# Altium project USB_Sniffer.PrjPcb
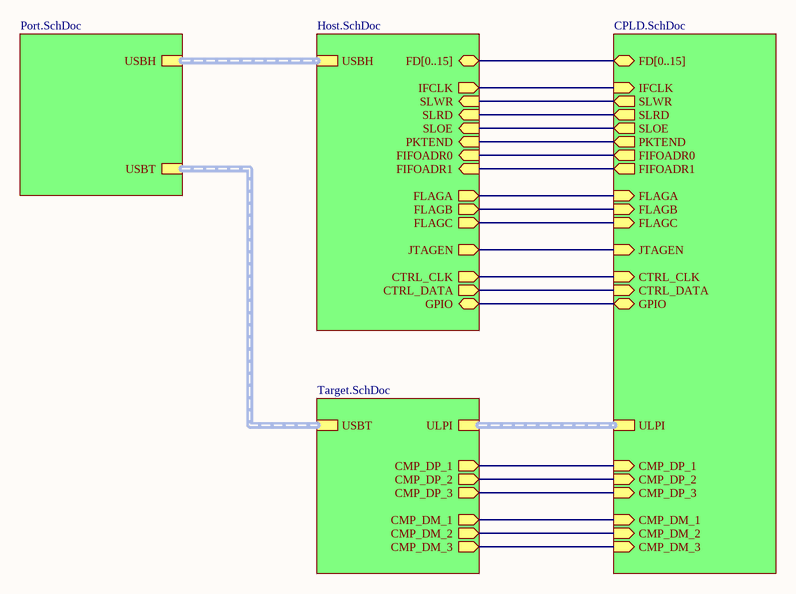
[diagram p0: Main.SchDoc]
5 sheets, 83 parts. Net scope: hierarchical (ports join the sheet entries above them; power ports are global).
Board file: USB_Sniffer.PcbDoc
Sheets:
  Main.SchDoc
    U_Port = Port.SchDoc
    U_Host = Host.SchDoc
    U_CPLD = CPLD.SchDoc
    U_Target = Target.SchDoc

## Sheet Main.SchDoc: Main
size A4; DocumentNumber: 1; SheetNumber: 1; SheetTotal: 5

### Sub-sheets
U_CPLD = CPLD.SchDoc: CTRL_CLK (in), JTAGEN (in), SLOE (out), FIFOADR0 (out), FIFOADR1 (out), PKTEND (out), GPIO (bidir), FD[0..15] (bidir), SLRD (out), SLWR (out), FLAGA (in), FLAGB (in), FLAGC (in), IFCLK (in), ULPI (harness ULPI), CMP_DM_1 (in), CMP_DP_1 (in), CMP_DP_2 (in), CMP_DM_2 (in), CMP_DP_3 (in), CMP_DM_3 (in), CTRL_DATA (in)
U_Host = Host.SchDoc: USBH (harness USB), CTRL_CLK (out), JTAGEN (out), SLOE (in), CTRL_DATA (out), FIFOADR0 (in), FIFOADR1 (in), PKTEND (in), GPIO (bidir), FD[0..15] (bidir), SLRD (in), SLWR (in), FLAGA (out), FLAGB (out), FLAGC (out), IFCLK (out)
U_Port = Port.SchDoc: USBH (harness USB), USBT (harness USB)
U_Target = Target.SchDoc: USBT (harness USB), ULPI (harness ULPI), CMP_DM_1 (out), CMP_DP_1 (out), CMP_DP_2 (out), CMP_DM_2 (out), CMP_DP_3 (out), CMP_DM_3 (out)

### Nets
CMP_DM_1: sheet U_CPLD/CMP_DM_1, sheet U_Target/CMP_DM_1
CMP_DM_2: sheet U_CPLD/CMP_DM_2, sheet U_Target/CMP_DM_2
CMP_DM_3: sheet U_CPLD/CMP_DM_3, sheet U_Target/CMP_DM_3
CMP_DP_1: sheet U_CPLD/CMP_DP_1, sheet U_Target/CMP_DP_1
CMP_DP_2: sheet U_CPLD/CMP_DP_2, sheet U_Target/CMP_DP_2
CMP_DP_3: sheet U_CPLD/CMP_DP_3, sheet U_Target/CMP_DP_3
CTRL_CLK: sheet U_Host/CTRL_CLK, sheet U_CPLD/CTRL_CLK
CTRL_DATA: sheet U_Host/CTRL_DATA, sheet U_CPLD/CTRL_DATA
FIFOADR0: sheet U_Host/FIFOADR0, sheet U_CPLD/FIFOADR0
FIFOADR1: sheet U_Host/FIFOADR1, sheet U_CPLD/FIFOADR1
FLAGA: sheet U_Host/FLAGA, sheet U_CPLD/FLAGA
FLAGB: sheet U_Host/FLAGB, sheet U_CPLD/FLAGB
FLAGC: sheet U_Host/FLAGC, sheet U_CPLD/FLAGC
GPIO: sheet U_Host/GPIO, sheet U_CPLD/GPIO
IFCLK: sheet U_Host/IFCLK, sheet U_CPLD/IFCLK
JTAGEN: sheet U_Host/JTAGEN, sheet U_CPLD/JTAGEN
PKTEND: sheet U_Host/PKTEND, sheet U_CPLD/PKTEND
SLOE: sheet U_Host/SLOE, sheet U_CPLD/SLOE
SLRD: sheet U_Host/SLRD, sheet U_CPLD/SLRD
SLWR: sheet U_Host/SLWR, sheet U_CPLD/SLWR

### Buses and harness runs
bus sheet U_CPLD/FD[0..15] = sheet U_Host/FD[0..15]
harness sheet U_CPLD/ULPI = sheet U_Target/ULPI
harness sheet U_Host/USBH = sheet U_Port/USBH
harness sheet U_Port/USBT = sheet U_Target/USBT

### Notes on the sheet
- Title
- Size:
- Date:
- A4
- Number:
- Time:
- Revision:
- Sheet
- of
- File:

## Sheet Port.SchDoc: Port
size A4; DocumentNumber: 2; SheetNumber: 2; SheetTotal: 5
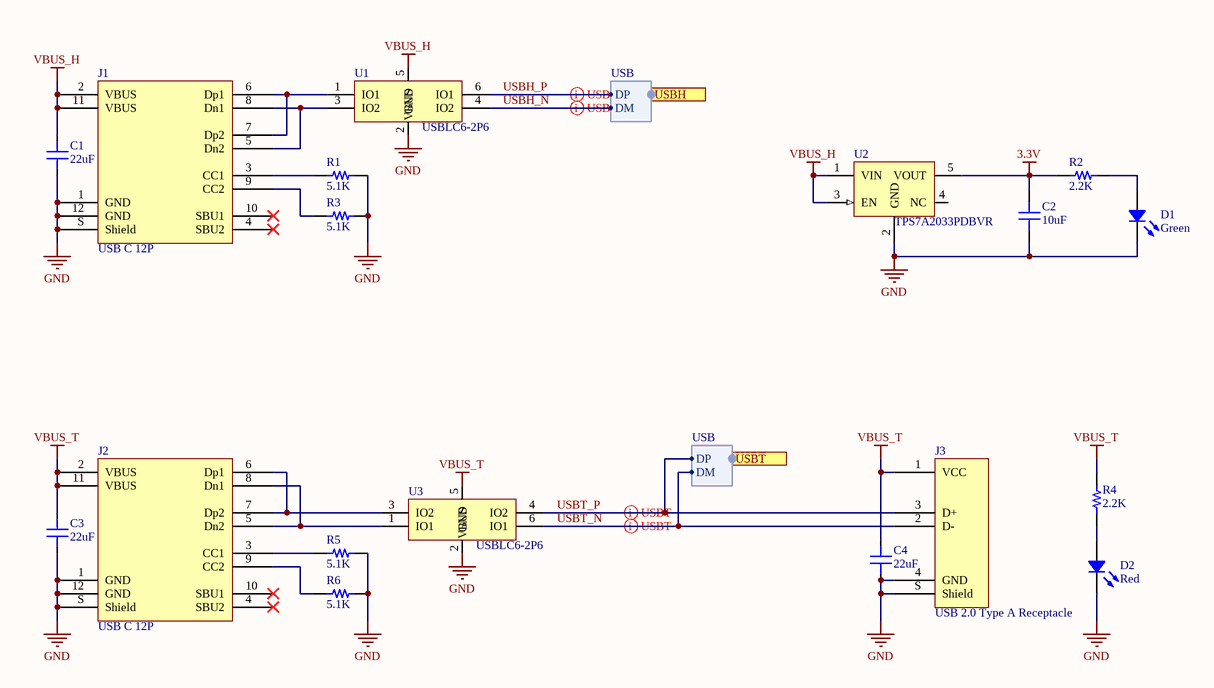
[diagram p1: Port.SchDoc]

### Parts
C1  22uF  [CAP 0805/2012]
C2  10uF  [CAP 0603/1608]
C3  22uF  [CAP 0805/2012]
C4  22uF  [CAP 0805/2012]
D1  Green  [LED 0603/1608 GREEN]
D2  Red  [LED 0603/1608 RED]
J1  USB C 12P  [JAE USB DX07S016JA1R1500]
J2  USB C 12P  [JAE USB DX07S016JA1R1500]
J3  USB 2.0 Type A Receptacle  [629104151021]
R1  5.1K  [RES 0402/1005]
R2  2.2K  [RES 0402/1005]
R3  5.1K  [RES 0402/1005]
R4  2.2K  [RES 0402/1005]
R5  5.1K  [RES 0402/1005]
R6  5.1K  [RES 0402/1005]
U1  USBLC6-2P6  [SOTFL50P160X60-6N]
U2  TPS7A2033PDBVR  [SOT95P280X110-5N]
U3  USBLC6-2P6  [SOTFL50P160X60-6N]

### Ports
USBH (harness USB), USBT (harness USB)

### Harnesses
USB: DP, DM

### Nets
3.3V: C2.2 R2.2 U2.5(VOUT)
GND: C1.1 C2.1 C3.1 C4.1 D1.2 D2.2 J1.1(GND) J1.12(GND) J1.S(Shield) J2.1(GND) J2.12(GND) J2.S(Shield) J3.4(GND) J3.S(Shield) R1.1 R3.1 R5.1 R6.1 U1.2(GND) U2.2(GND) U3.2(GND)
VBUS_H: C1.2 J1.2(VBUS) J1.11(VBUS) U1.5(VBUS) U2.1(VIN) U2.3(EN)
VBUS_T: C3.2 C4.2 J2.2(VBUS) J2.11(VBUS) J3.1(VCC) R4.1 U3.5(VBUS)
USBH_N: U1.4(IO2) ; port USBH.DM
USBH_P: U1.6(IO1) ; port USBH.DP
USBT_N: J3.2(D-) U3.6(IO1) ; port USBT.DM
USBT_P: J3.3(D+) U3.4(IO2) ; port USBT.DP
NetD1_1: D1.1 R2.1
NetD2_1: D2.1 R4.2
NetJ1_3: J1.3(CC1) R1.2
NetJ1_5: J1.5(Dn2) J1.8(Dn1) U1.3(IO2)
NetJ1_6: J1.6(Dp1) J1.7(Dp2) U1.1(IO1)
NetJ1_9: J1.9(CC2) R3.2
NetJ2_3: J2.3(CC1) R5.2
NetJ2_5: J2.5(Dn2) J2.8(Dn1) U3.1(IO1)
NetJ2_6: J2.6(Dp1) J2.7(Dp2) U3.3(IO2)
NetJ2_9: J2.9(CC2) R6.2

Not connected (* = marked no-connect by the designer): J1 4(SBU2)* 10(SBU1)*; J2 4(SBU2)* 10(SBU1)*; U2 4(NC)

### Layout directives
differential pair: USBH_N, USBH_P, USBT_N, USBT_P

### Notes on the sheet
- Title
- Size:
- Date:
- A4
- Number:
- Time:
- Revision:
- Sheet
- of
- File:

### Library data of the parts
C1 C3 C4 = CM1163: CAP CER 22UF 10V X5R 0805; Part Number: GRM219R61A226MEA0D; Manufacturer: Murata; TemperatureRange: -55C ~ 85C; Tolerance: 20%; Value: 22uF; PartId: CM1163; Supplier 1: Digi-Key; Supplier Part Number 1: 490-9951-2-ND; ComponentLink1Description: Datasheet; ComponentLink1URL: http://www.murata.com/~/media/webrenewal/support/library/catalog/products/capacitor/mlcc/c02e.pdf; ComponentLink2Description: Digi-Key Listing; ComponentLink2URL: https://www.digikey.com/product-detail/en/murata-electronics-north-america/GRM219R61A226MEA0D/490-9951-2-ND/4905417; TemperatureCoefficient: X5R; Voltage: 10V; Price: 0.0844; Device Package: 0805 (2012 Metric)
C2 = CM0905: CAP CER 10UF 25V X5R 0603; Part Number: GRM188R61E106MA73D; Manufacturer: Murata; TemperatureRange: -55C ~ 85C; Tolerance: 20%; Value: 10uF; PartId: CM0905; Supplier 1: Digi-Key; Supplier Part Number 1: 490-7202-2-ND; ComponentLink1Description: Datasheet; ComponentLink1URL: http://www.murata.com/~/media/webrenewal/support/library/catalog/products/capacitor/mlcc/c02e.pdf; ComponentLink2Description: Digi-Key Listing; ComponentLink2URL: https://www.digikey.com/product-detail/en/murata-electronics-north-america/GRM188R61E106MA73D/490-7202-2-ND/3900497; TemperatureCoefficient: X5R; Voltage: 25V; Price: 0.0858; Device Package: 0603 (1608 Metric)
D1 = LS0044: LED GREEN CLEAR 0603 SMD; Part Number: LTST-C191KGKT; Manufacturer: Lite-On Inc.; Type: Surface Mount; Millicandela: 35mcd; Voltage Forward: 2V; Current (Test): 20mA; Viewing Angle: 130; Value: Green; Colour: Green; PartId: LS0044; Supplier 1: Digi-Key; Supplier Part Number 1: 160-1446-2-ND; ComponentLink1Description: Datasheet; ComponentLink1URL: http://optoelectronics.liteon.com/upload/download/DS22-2000-228/LTST-C191KGKT.pdf; ComponentLink2Description: Digi-Key Listing; ComponentLink2URL: http://www.digikey.ca/product-detail/en/LTST-C191KGKT/160-1446-2-ND/386835; Price: 0.0521; Device Package: 0603 (1608 Metric); Lens Transparency: Clear
D2 = LS0043: LED RED CLEAR 0603 SMD; Part Number: LTST-C191KRKT; Manufacturer: Lite-On Inc.; Value: Green; Millicandela: 54mcd; Voltage Forward: 2V; Current (Test): 20mA; Viewing Angle: 130; Colour: Red; PartId: LS0043; Supplier 1: Digi-Key; Supplier Part Number 1: 160-1447-2-ND; ComponentLink1Description: Datasheet; ComponentLink1URL: http://optoelectronics.liteon.com/upload/download/DS22-2000-223/LTST-C191KRKT.pdf; ComponentLink2Description: Digi-Key Listing; ComponentLink2URL: http://www.digikey.ca/product-detail/en/LTST-C191KRKT/160-1447-2-ND/386837; Price: 0.0521; Device Package: 0603 (1608 Metric); Lens Transparency: Clear
J1 J2 = CU0055: USB 2.0 Type C, Receptacle, Horizontal, SMT; Part Number: DX07S016JA1R1500; Manufacturer: JAE; Number Of Positions: 12; PartId: CU0055; Supplier 1: Digi-Key; Supplier Part Number 1: 670-DX07S016JA1R1500CT-ND; ComponentLink1Description: Datasheet; ComponentLink1URL: https://www.jae.com/en/connectors/series/detail/product/id=91780&type_code=T1010; Supplier 2: Mouser; Supplier Part Number 2: 656-DX07S016JA1R1500; Type: USB - C
J3 = CU0022: USB 2.0 Type A, Receptacle, Horizontal, SMT, with Pegs; Manufacturer: Wurth; Number Of Positions: 4; PartId: CU0022; Part Number: 629104151021; Supplier 1: Mouser; Supplier Part Number 1: 710-629104151021; ComponentLink1Description: Datasheet; ComponentLink1URL: https://www.we-online.com/components/products/datasheet/629104151021.pdf; Type: USB - A
R1 R3 R5 R6 = RC1490: RES SMD 5.1K OHM 1% 1/16W 0402; Part Number: RC0402FR-075K1L; Manufacturer: Yageo; TemperatureRange: -55C ~ 155C; TemperatureCoefficient: 100ppm/C; PowerRating: 0.0625W, 1/16W; Value: 5.1K; PartId: RC1490; Supplier 1: Mouser; Supplier Part Number 1: 603-RC0402FR-075K1L; ComponentLink1Description: Datasheet; ComponentLink1URL: http://www.yageo.com/NewPortal/yageodocoutput?fileName=/pdf/R-Chip/PYu-RC_Group_51_RoHS_L_9.pdf; Tolerance: 1%; Price: 0.0043; Type: Thick Film; Device Package: 0402 (1005 Metric)
R2 R4 = RC1434: RES SMD 2.2K OHM 1% 1/16W 0402; Part Number: RC0402FR-072K2L; Manufacturer: Yageo; TemperatureRange: -55C ~ 155C; TemperatureCoefficient: 100ppm/C; PowerRating: 0.0625W, 1/16W; PartId: RC1434; Value: 2.2K; Supplier 1: Mouser; Supplier Part Number 1: 603-RC0402FR-072K2L; ComponentLink1Description: Datasheet; ComponentLink1URL: http://www.yageo.com/NewPortal/yageodocoutput?fileName=/pdf/R-Chip/PYu-RC_Group_51_RoHS_L_9.pdf; Tolerance: 1%; Price: 0.0043; Type: Thick Film; Device Package: 0402 (1005 Metric)
U1 U3 = IIF001: TVS ARRAY SOT666; Manufacturer: ST; PartId: IIF001; Part Number: USBLC6-2P6; Supplier 1: Digi-Key; Supplier Part Number 1: 497-5026-1-ND; Supplier 2: Farnell; Supplier Part Number 2: 1295310; ComponentLink1Description: Datasheet; ComponentLink1URL: http://www.st.com/resource/en/datasheet/usblc6-2.pdf; Price: 0.58; Type: ESD Diode; Device Package: SOTFL-6; Operating Temperature: -40C ~ 125C
U2 = URL111: LDO 3.3V 300MA SOT23-5; Manufacturer: TI; Input Voltage MAX: 5.5V; PartId: URL111; Part Number: TPS7A2033PDBVR; Supplier 1: Mouser; Supplier Part Number 1: 595-TPS7A2033PDBVR; ComponentLink1Description: Datasheet; ComponentLink1URL: https://www.ti.com/lit/ds/symlink/tps7a20.pdf; Price: 0.15; Type: LDO; Device Package: SOT23-5; Operating Temperature: -40C ~ 125C; Output Voltage: 3.3V; Output Current: 300mA

## Sheet Host.SchDoc: MCU
size A4; DocumentNumber: 3; SheetNumber: 3; SheetTotal: 5
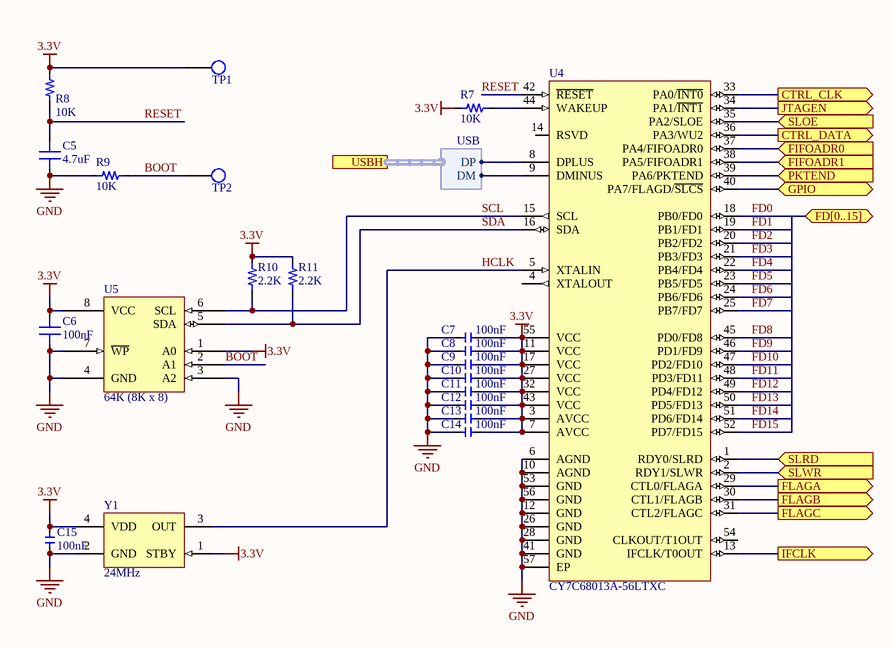
[diagram p2: Host.SchDoc]

### Parts
C5  4.7uF  [CAP 0402/1005]
C6  100nF  [CAP 0402/1005]
C7  100nF  [CAP 0402/1005]
C8  100nF  [CAP 0402/1005]
C9  100nF  [CAP 0402/1005]
C10  100nF  [CAP 0402/1005]
C11  100nF  [CAP 0402/1005]
C12  100nF  [CAP 0402/1005]
C13  100nF  [CAP 0402/1005]
C14  100nF  [CAP 0402/1005]
C15  100nF  [CAP 0402/1005]
R7  10K  [RES 0402/1005]
R8  10K  [RES 0402/1005]
R9  10K  [RES 0402/1005]
R10  2.2K  [RES 0402/1005]
R11  2.2K  [RES 0402/1005]
TP1  Test Point  [TP 1MM]  (value not drawn)  (no BOM)
TP2  Test Point  [TP 1MM]  (value not drawn)  (no BOM)
U4  CY7C68013A-56LTXC  [QFN50P800X800X90_HS-57N]
U5  64K (8K x 8)  [MICROCHIP TSSOP-8 ST]
Y1  24MHz  [WE-SPXO_IQXO-540]

### Ports
CTRL_CLK (out), CTRL_DATA (out), FD[0..15] (bidir), FIFOADR0 (in), FIFOADR1 (in), FLAGA (out), FLAGB (out), FLAGC (out), GPIO (bidir), IFCLK (out), JTAGEN (out), PKTEND (in), SLOE (in), SLRD (in), SLWR (in), USBH (harness USB)

### Harnesses
USB: DP, DM

### Nets
3.3V: C6.1 C7.1 C8.2 C9.2 C10.2 C11.2 C12.2 C13.2 C14.2 C15.1 R7.2 R8.2 R10.2 R11.2 TP1.1 U4.3(AVCC) U4.7(AVCC) U4.11(VCC) U4.17(VCC) U4.27(VCC) U4.32(VCC) U4.43(VCC) U4.55(VCC) U5.1(A0) U5.8(VCC) Y1.1(STBY) Y1.4(VDD)
GND: C5.2 C6.2 C7.2 C8.1 C9.1 C10.1 C11.1 C12.1 C13.1 C14.1 C15.2 R9.1 U4.6(AGND) U4.10(AGND) U4.12(GND) U4.26(GND) U4.28(GND) U4.41(GND) U4.53(GND) U4.56(GND) U4.57(EP) U5.3(A2) U5.4(GND) U5.7(~{WP}) Y1.2(GND)
BOOT: R9.2 TP2.1 U5.2(A1)
CTRL_CLK: U4.33(PA0/~{INT0}) ; port CTRL_CLK
CTRL_DATA: U4.36(PA3/WU2) ; port CTRL_DATA
FD0: U4.18(PB0/FD0)
FD1: U4.19(PB1/FD1)
FD2: U4.20(PB2/FD2)
FD3: U4.21(PB3/FD3)
FD4: U4.22(PB4/FD4)
FD5: U4.23(PB5/FD5)
FD6: U4.24(PB6/FD6)
FD7: U4.25(PB7/FD7)
FD8: U4.45(PD0/FD8)
FD9: U4.46(PD1/FD9)
FD10: U4.47(PD2/FD10)
FD11: U4.48(PD3/FD11)
FD12: U4.49(PD4/FD12)
FD13: U4.50(PD5/FD13)
FD14: U4.51(PD6/FD14)
FD15: U4.52(PD7/FD15)
FIFOADR0: U4.37(PA4/FIFOADR0) ; port FIFOADR0
FIFOADR1: U4.38(PA5/FIFOADR1) ; port FIFOADR1
FLAGA: U4.29(CTL0/FLAGA) ; port FLAGA
FLAGB: U4.30(CTL1/FLAGB) ; port FLAGB
FLAGC: U4.31(CTL2/FLAGC) ; port FLAGC
GPIO: U4.40(PA7/FLAGD/~{SLCS}) ; port GPIO
HCLK: U4.5(XTALIN) Y1.3(OUT)
IFCLK: U4.13(IFCLK/T0OUT) ; port IFCLK
JTAGEN: U4.34(PA1/~{INT1}) ; port JTAGEN
PKTEND: U4.39(PA6/PKTEND) ; port PKTEND
RESET: C5.1 R8.1 U4.42(~{RESET})
SCL: R10.1 U4.15(SCL) U5.6(SCL)
SDA: R11.1 U4.16(SDA) U5.5(SDA)
SLOE: U4.35(PA2/SLOE) ; port SLOE
SLRD: U4.1(RDY0/SLRD) ; port SLRD
SLWR: U4.2(RDY1/SLWR) ; port SLWR
USBH_N: U4.9(DMINUS) ; port USBH.DM
USBH_P: U4.8(DPLUS) ; port USBH.DP
NetR7_1: R7.1 U4.44(WAKEUP)

Not connected (* = marked no-connect by the designer): U4 4(XTALOUT) 14(RSVD) 54(CLKOUT/T1OUT)

### Notes on the sheet
- Title
- Size:
- Date:
- A4
- Number:
- Time:
- Revision:
- Sheet
- of
- File:

### Library data of the parts
C5 = CM0507: CAP CER 4.7UF 6.3V X5R 0402; Part Number: GRM155R60J475ME87D; Manufacturer: Murata; TemperatureRange: -55C ~ 85C; Tolerance: 20%; PartId: CM0507; Value: 4.7uF; Supplier 1: Digi-Key; Supplier Part Number 1: 490-5408-2-ND; ComponentLink1Description: Datasheet; ComponentLink1URL: http://www.murata.com/~/media/webrenewal/support/library/catalog/products/capacitor/mlcc/c02e.pdf; ComponentLink2Description: Digi-Key Listing; ComponentLink2URL: https://www.digikey.com/product-detail/en/murata-electronics-north-america/GRM155R60J475ME87D/490-5408-2-ND/2175194; TemperatureCoefficient: X5R; Voltage: 6.3V; Price: 0.0194; Device Package: 0402 (1005 Metric)
C6-C15 = CM0464: CAP CER 100NF 25V X5R 0402; Part Number: GRM155R61E104KA87D; Manufacturer: Murata; TemperatureRange: -55C ~ 85C; Tolerance: 10%; Value: 100nF; PartId: CM0464; Supplier 1: Digi-Key; Supplier Part Number 1: 490-5920-2-ND; ComponentLink1Description: Datasheet; ComponentLink1URL: http://www.murata.com/~/media/webrenewal/support/library/catalog/products/capacitor/mlcc/c02e.pdf; ComponentLink2Description: Digi-Key Listing; ComponentLink2URL: https://www.digikey.com/product-detail/en/murata-electronics-north-america/GRM155R61E104KA87D/490-5920-2-ND/3693681; TemperatureCoefficient: X5R; Voltage: 25V; Price: 0.0048; Device Package: 0402 (1005 Metric)
R7-R9 = RC1531: RES SMD 10K OHM 1% 1/16W 0402; Part Number: RC0402FR-0710KL; Manufacturer: Yageo; TemperatureRange: -55C ~ 155C; TemperatureCoefficient: 100ppm/C; PowerRating: 0.0625W, 1/16W; PartId: RC1531; Value: 10K; Supplier 1: Mouser; Supplier Part Number 1: 603-RC0402FR-0710KL; ComponentLink1Description: Datasheet; ComponentLink1URL: http://www.yageo.com/NewPortal/yageodocoutput?fileName=/pdf/R-Chip/PYu-RC_Group_51_RoHS_L_9.pdf; Tolerance: 1%; Price: 0.0043; Type: Thick Film; Device Package: 0402 (1005 Metric)
R10 R11 = RC1434: as R2 on sheet Port; PartId: RC1434; Value: 2.2K; Supplier 1: Mouser; Supplier Part Number 1: 603-RC0402FR-072K2L; ComponentLink1Description: Datasheet; ComponentLink1URL: http://www.yageo.com/NewPortal/yageodocoutput?fileName=/pdf/R-Chip/PYu-RC_Group_51_RoHS_L_9.pdf; Tolerance: 1%; Price: 0.0043; Type: Thick Film; Device Package: 0402 (1005 Metric)
U4 = IIF024: MCU USB PHERIPH FX2LP 56VQFN; Manufacturer: Infineon; PartId: IIF024; Part Number: CY7C68013A-56LTXC; Supplier 1: Digi-Key; Supplier Part Number 1: 448-CY7C68013A-56LTXC-ND; Supplier 2: Mouser; Supplier Part Number 2: 727-CY7C68013A56LTXC; ComponentLink1Description: Datasheet; ComponentLink1URL: https://www.infineon.com/dgdl/Infineon-CY7C68013A_CY7C68014A_CY7C68015A_CY7C68016A_EZ-USB_FX2LP_USB_Microcontroller_High-Speed_USB_Peripheral_Controller-DataSheet-v31_00-EN.pdf?fileId=8ac78c8c7d0d8da4017d0ec9f7974252; Price: 12; Type: USB Microcontroller; Device Package: 56-QFN (8x8); Operating Temperature: 0C ~ 70C
U5 = ME0028: IC EEPROM 64KBIT 400KHZ 8TSSOP; Part Number: 24LC64-I/ST; Manufacturer: Microchip Technology; Interface: I2C, 2-Wire Serial; Voltage - Supply: 2.5 V ~ 5.5 V; PartId: ME0028; Supplier 1: Digi-Key; Supplier Part Number 1: 24LC64-I/ST-ND; ComponentLink1Description: Datasheet; ComponentLink1URL: http://www.microchip.com/mymicrochip/filehandler.aspx?ddocname=en011843; ComponentLink2Description: Digi-Key Listing; ComponentLink2URL: http://www.digikey.com/product-detail/en/24LC64-I%2FST/24LC64-I%2FST-ND/443537; Price: 0.42; Type: EEPROM; Device Package: 8-TSSOP (0.173", 4.40mm Width); Operating Temperature: -40C ~ 85C; Memory Type: EEPROM; Memory Size: 64K (8K x 8); Speed: 400kHz
Y1 = OX0029: OSC XO 24MHz 3.3V 2016 SMD; Part Number: 830208215109; Manufacturer: Wurth; Frequency Stability: 25ppm; Load Capacitance: 15pF; PartId: OX0029; Value: 24MHz; Supplier 1: Mouser; Supplier Part Number 1: 710-830208215109; ComponentLink1Description: Datasheet; ComponentLink1URL: https://www.we-online.com/redexpert/spec/830208215109?ad; Price: 0.4; Type: XO (Standard); Device Package: 4-SMD, 2016; Series: IQXO-540; Frequency: 24MHz; Supply Voltage: 3.3V
TP1 TP2 = Test Point: PartId: Test Point; Component Type: Standard (No BOM); Pin Count: 1

## Sheet CPLD.SchDoc: CPLD
size A4; DocumentNumber: 4; SheetNumber: 4; SheetTotal: 5
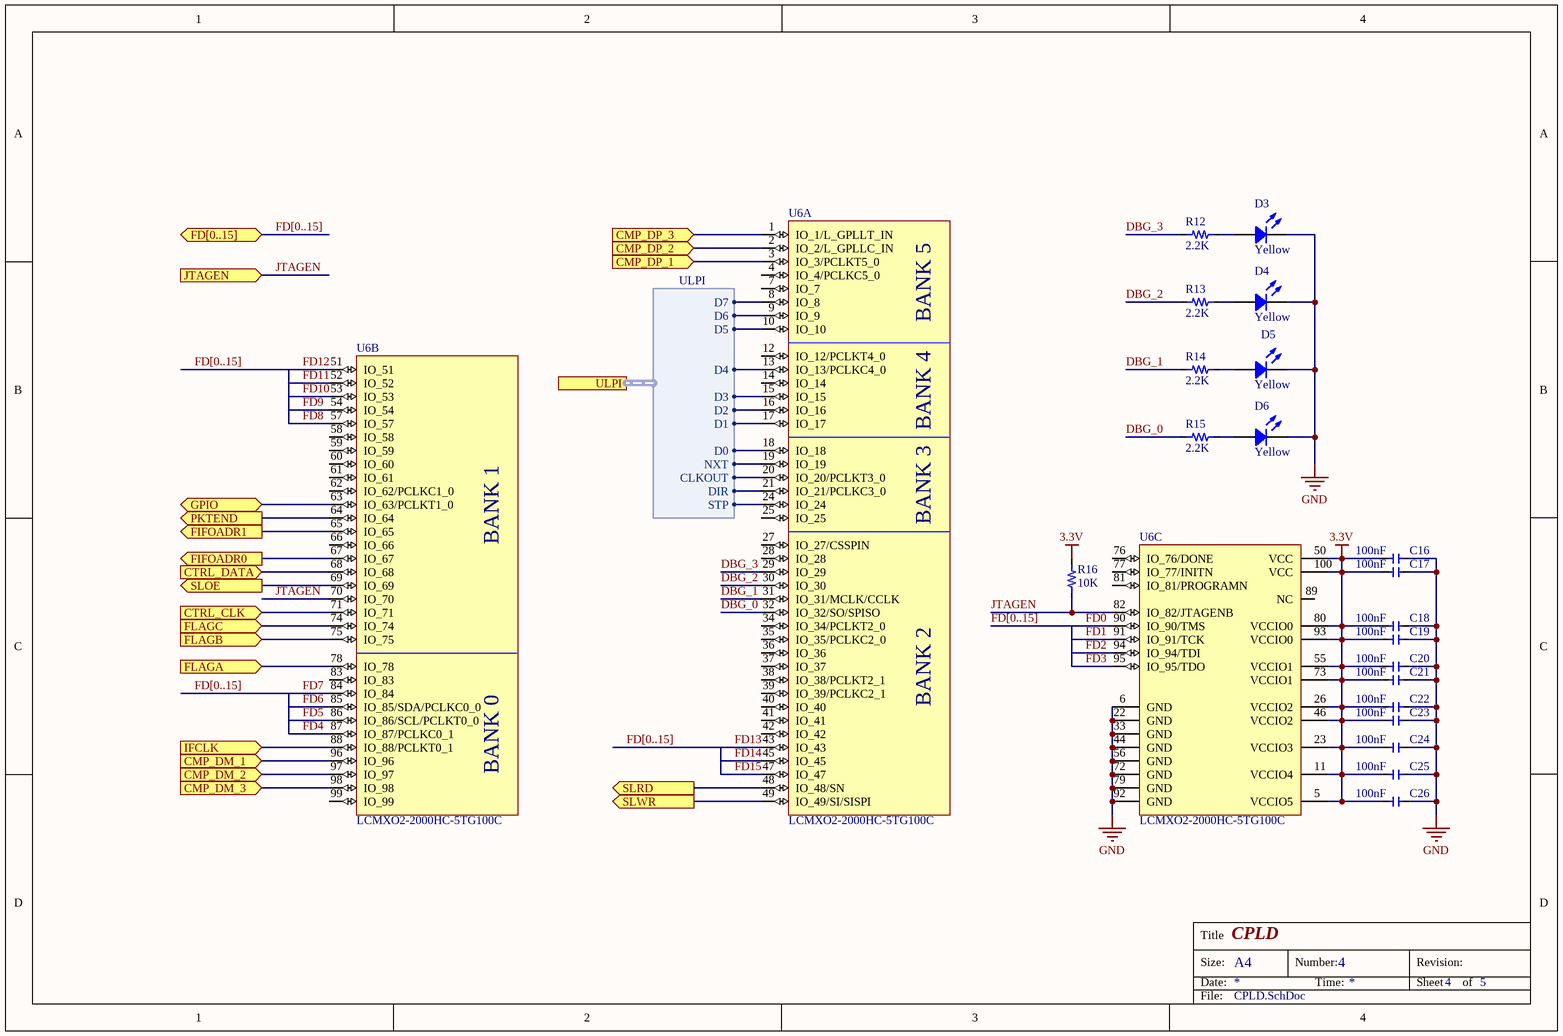
[diagram p3: CPLD.SchDoc]

### Parts
C16  100nF  [CAP 0402/1005]
C17  100nF  [CAP 0402/1005]
C18  100nF  [CAP 0402/1005]
C19  100nF  [CAP 0402/1005]
C20  100nF  [CAP 0402/1005]
C21  100nF  [CAP 0402/1005]
C22  100nF  [CAP 0402/1005]
C23  100nF  [CAP 0402/1005]
C24  100nF  [CAP 0402/1005]
C25  100nF  [CAP 0402/1005]
C26  100nF  [CAP 0402/1005]
D3  Yellow  [LED 0603/1608 YELLOW]
D4  Yellow  [LED 0603/1608 YELLOW]
D5  Yellow  [LED 0603/1608 YELLOW]
D6  Yellow  [LED 0603/1608 YELLOW]
R12  2.2K  [RES 0402/1005]
R13  2.2K  [RES 0402/1005]
R14  2.2K  [RES 0402/1005]
R15  2.2K  [RES 0402/1005]
R16  10K  [RES 0402/1005]
U6  LCMXO2-2000HC-5TG100C  [NXP LQFP-100 14x14mm]  (parts A,B,C of 3)

### Ports
CMP_DM_1 (in), CMP_DM_2 (in), CMP_DM_3 (in), CMP_DP_1 (in), CMP_DP_2 (in), CMP_DP_3 (in), CTRL_CLK (in), CTRL_DATA (in), FD[0..15] (bidir), FIFOADR0 (out), FIFOADR1 (out), FLAGA (in), FLAGB (in), FLAGC (in), GPIO (bidir), IFCLK (in), JTAGEN (in), PKTEND (out), SLOE (out), SLRD (out), SLWR (out), ULPI (harness ULPI)

### Harnesses
ULPI: CLKOUT, D0, D1, D2, D3, D4, D5, D6, D7, DIR, NXT, STP

### Nets
3.3V: C16.1 C17.2 C18.1 C19.1 C20.1 C21.1 C22.1 C23.1 C24.1 C25.1 C26.1 R16.2 U6.5(VCCIO5) U6.11(VCCIO4) U6.23(VCCIO3) U6.26(VCCIO2) U6.46(VCCIO2) U6.50(VCC) U6.55(VCCIO1) U6.73(VCCIO1) U6.80(VCCIO0) U6.93(VCCIO0) U6.100(VCC)
GND: C16.2 C17.1 C18.2 C19.2 C20.2 C21.2 C22.2 C23.2 C24.2 C25.2 C26.2 D3.2 D4.2 D5.2 D6.2 U6.6(GND) U6.22(GND) U6.33(GND) U6.44(GND) U6.56(GND) U6.72(GND) U6.79(GND) U6.92(GND)
CMP_DM_1: U6.96(IO_96) ; port CMP_DM_1
CMP_DM_2: U6.97(IO_97) ; port CMP_DM_2
CMP_DM_3: U6.98(IO_98) ; port CMP_DM_3
CMP_DP_1: U6.3(IO_3/PCLKT5_0) ; port CMP_DP_1
CMP_DP_2: U6.2(IO_2/L_GPLLC_IN) ; port CMP_DP_2
CMP_DP_3: U6.1(IO_1/L_GPLLT_IN) ; port CMP_DP_3
CTRL_CLK: U6.71(IO_71) ; port CTRL_CLK
CTRL_DATA: U6.68(IO_68) ; port CTRL_DATA
DBG_0: R15.2 U6.32(IO_32/SO/SPISO)
DBG_1: R14.2 U6.31(IO_31/MCLK/CCLK)
DBG_2: R13.2 U6.30(IO_30)
DBG_3: R12.2 U6.29(IO_29)
FD0: U6.90(IO_90/TMS)
FD1: U6.91(IO_91/TCK)
FD2: U6.94(IO_94/TDI)
FD3: U6.95(IO_95/TDO)
FD4: U6.87(IO_87/PCLKC0_1)
FD5: U6.86(IO_86/SCL/PCLKT0_0)
FD6: U6.85(IO_85/SDA/PCLKC0_0)
FD7: U6.84(IO_84)
FD8: U6.57(IO_57)
FD9: U6.54(IO_54)
FD10: U6.53(IO_53)
FD11: U6.52(IO_52)
FD12: U6.51(IO_51)
FD13: U6.43(IO_43)
FD14: U6.45(IO_45)
FD15: U6.47(IO_47)
FIFOADR0: U6.67(IO_67) ; port FIFOADR0
FIFOADR1: U6.65(IO_65) ; port FIFOADR1
FLAGA: U6.78(IO_78) ; port FLAGA
FLAGB: U6.75(IO_75) ; port FLAGB
FLAGC: U6.74(IO_74) ; port FLAGC
GPIO: U6.63(IO_63/PCLKT1_0) ; port GPIO
IFCLK: U6.88(IO_88/PCLKT0_1) ; port IFCLK
JTAGEN: R16.1 U6.70(IO_70) U6.82(IO_82/JTAGENB) ; port JTAGEN
PKTEND: U6.64(IO_64) ; port PKTEND
SLOE: U6.69(IO_69) ; port SLOE
SLRD: U6.48(IO_48/SN) ; port SLRD
SLWR: U6.49(IO_49/SI/SISPI) ; port SLWR
NetD3_1: D3.1 R12.1
NetD4_1: D4.1 R13.1
NetD5_1: D5.1 R14.1
NetD6_1: D6.1 R15.1
NetU6_8: U6.8(IO_8) ; port ULPI.D7
NetU6_9: U6.9(IO_9) ; port ULPI.D6
NetU6_10: U6.10(IO_10) ; port ULPI.D5
NetU6_13: U6.13(IO_13/PCLKC4_0) ; port ULPI.D4
NetU6_15: U6.15(IO_15) ; port ULPI.D3
NetU6_16: U6.16(IO_16) ; port ULPI.D2
NetU6_17: U6.17(IO_17) ; port ULPI.D1
NetU6_18: U6.18(IO_18) ; port ULPI.D0
NetU6_19: U6.19(IO_19) ; port ULPI.NXT
NetU6_20: U6.20(IO_20/PCLKT3_0) ; port ULPI.CLKOUT
NetU6_21: U6.21(IO_21/PCLKC3_0) ; port ULPI.DIR
NetU6_24: U6.24(IO_24) ; port ULPI.STP

Not connected (* = marked no-connect by the designer): U6 4(IO_4/PCLKC5_0) 7(IO_7) 12(IO_12/PCLKT4_0) 14(IO_14) 25(IO_25) 27(IO_27/CSSPIN) 28(IO_28) 34(IO_34/PCLKT2_0) 35(IO_35/PCLKC2_0) 36(IO_36) 37(IO_37) 38(IO_38/PCLKT2_1) 39(IO_39/PCLKC2_1) 40(IO_40) 41(IO_41) 42(IO_42) 58(IO_58) 59(IO_59) 60(IO_60) 61(IO_61) 62(IO_62/PCLKC1_0) 66(IO_66) 76(IO_76/DONE) 77(IO_77/INITN) 81(IO_81/PROGRAMN) 83(IO_83) 89(NC) 99(IO_99)

### Buses and harness runs
bus FD[0..15]
bus FD[0..15] = port FD[0..15]

### Notes on the sheet
- Title
- Size:
- Date:
- A4
- Number:
- Time:
- Revision:
- Sheet
- of
- File:
- (in symbol UFL004, part A) BANK 5; BANK 4; BANK 3; BANK 2
- (in symbol UFL004, part B) BANK 1; BANK 0

### Library data of the parts
C16-C26 = CM0464: as C6 on sheet Host; Value: 100nF; PartId: CM0464; Supplier 1: Digi-Key; Supplier Part Number 1: 490-5920-2-ND; ComponentLink1Description: Datasheet; ComponentLink1URL: http://www.murata.com/~/media/webrenewal/support/library/catalog/products/capacitor/mlcc/c02e.pdf; ComponentLink2Description: Digi-Key Listing; ComponentLink2URL: https://www.digikey.com/product-detail/en/murata-electronics-north-america/GRM155R61E104KA87D/490-5920-2-ND/3693681; TemperatureCoefficient: X5R; Voltage: 25V; Price: 0.0048; Device Package: 0402 (1005 Metric)
D3-D6 = LS0046: LED YELLOW CLEAR 0603 SMD; Part Number: LTST-C191KSKT; Manufacturer: Lite-On Inc.; Value: Green; Type: Surface Mount; Millicandela: 104mcd; Voltage Forward: 2.1V; Current (Test): 20mA; Viewing Angle: 130; Colour: Yellow; PartId: LS0046; Supplier 1: Digi-Key; Supplier Part Number 1: 160-1448-2-ND; ComponentLink1Description: Datasheet; ComponentLink1URL: http://optoelectronics.liteon.com/upload/download/DS22-2000-224/LTST-C191KSKT.pdf; ComponentLink2Description: Digi-Key Listing; ComponentLink2URL: http://www.digikey.ca/product-detail/en/LTST-C191KSKT/160-1448-2-ND/386839; Price: 0.0555; Device Package: 0603 (1608 Metric); Lens Transparency: Clear
R12-R15 = RC1434: as R2 on sheet Port; PartId: RC1434; Value: 2.2K; Supplier 1: Mouser; Supplier Part Number 1: 603-RC0402FR-072K2L; ComponentLink1Description: Datasheet; ComponentLink1URL: http://www.yageo.com/NewPortal/yageodocoutput?fileName=/pdf/R-Chip/PYu-RC_Group_51_RoHS_L_9.pdf; Tolerance: 1%; Price: 0.0043; Type: Thick Film; Device Package: 0402 (1005 Metric)
R16 = RC1531: as R7 on sheet Host; PartId: RC1531; Value: 10K; Supplier 1: Mouser; Supplier Part Number 1: 603-RC0402FR-0710KL; ComponentLink1Description: Datasheet; ComponentLink1URL: http://www.yageo.com/NewPortal/yageodocoutput?fileName=/pdf/R-Chip/PYu-RC_Group_51_RoHS_L_9.pdf; Tolerance: 1%; Price: 0.0043; Type: Thick Film; Device Package: 0402 (1005 Metric)
U6 = UFL004: FPGA, MACHXO2, 2112 LUTs; Manufacturer: Lattice; PartId: UFL004; Part Number: LCMXO2-2000HC-5TG100C; Supplier 1: Digi-Key; Supplier Part Number 1: LCMXO2-2000HC-5TG100C-ND; Supplier 2: Mouser; Supplier Part Number 2: 842-XO22000HC5TG100C; ComponentLink1Description: Datasheet; ComponentLink1URL: https://www.latticesemi.com/view_document?document_id=38834; Price: 16; Type: FPGA; Device Package: 100-TQFP (14x14); Operating Temperature: -0C ~ 85C

## Sheet Target.SchDoc: Sniffer
size A4; DocumentNumber: 5; SheetNumber: 5; SheetTotal: 5
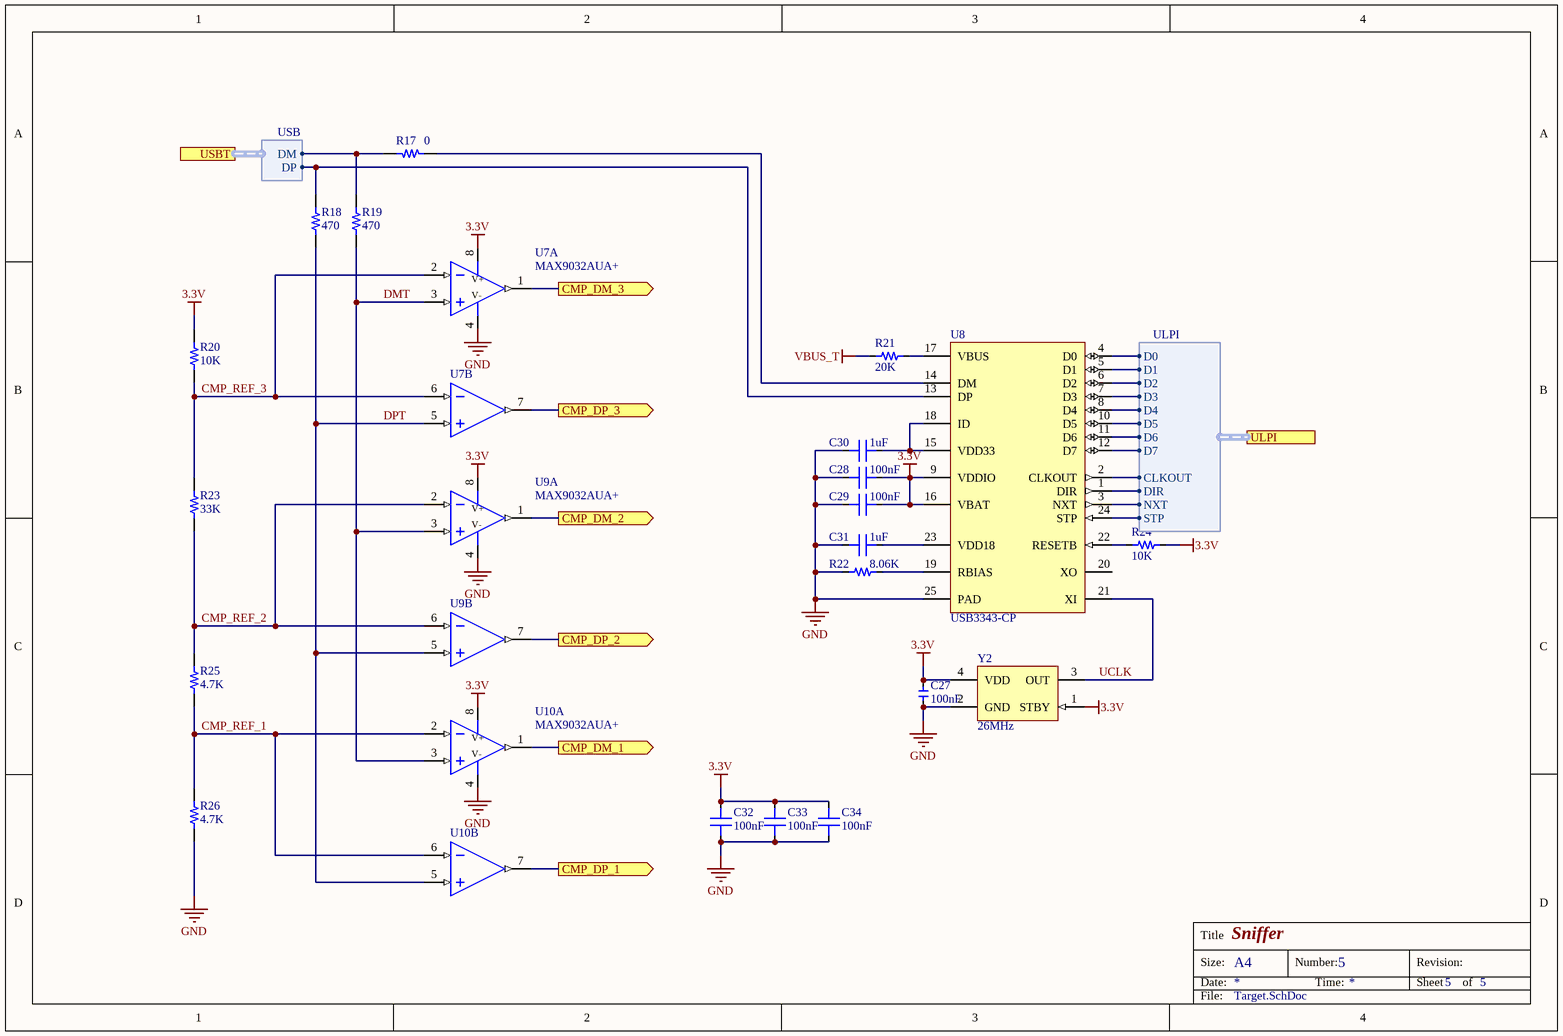
[diagram p4: Target.SchDoc]

### Parts
C27  100nF  [CAP 0402/1005]
C28  100nF  [CAP 0402/1005]
C29  100nF  [CAP 0402/1005]
C30  1uF  [CAP 0402/1005]
C31  1uF  [CAP 0402/1005]
C32  100nF  [CAP 0402/1005]
C33  100nF  [CAP 0402/1005]
C34  100nF  [CAP 0402/1005]
R17  0  [RES 0402/1005]
R18  470  [RES 0402/1005]
R19  470  [RES 0402/1005]
R20  10K  [RES 0402/1005]
R21  20K  [RES 0402/1005]
R22  8.06K  [RES 0402/1005]
R23  33K  [RES 0402/1005]
R24  10K  [RES 0402/1005]
R25  4.7K  [RES 0402/1005]
R26  4.7K  [RES 0402/1005]
U7  MAX9032AUA+  [TSOP65P490X110-8N]  (parts A,B of 2)
U8  USB3343-CP  [QFN50P400X400X80_HS-25N]
U9  MAX9032AUA+  [TSOP65P490X110-8N]  (parts A,B of 2)
U10  MAX9032AUA+  [TSOP65P490X110-8N]  (parts A,B of 2)
Y2  26MHz  [WE-SPXO_IQXO-540]

### Ports
CMP_DM_1 (out), CMP_DM_2 (out), CMP_DM_3 (out), CMP_DP_1 (out), CMP_DP_2 (out), CMP_DP_3 (out), ULPI (harness ULPI), USBT (harness USB)

### Harnesses
USB: DP, DM
ULPI: D0, D1, D2, D3, D4, D5, D6, D7, CLKOUT, DIR, NXT, STP

### Nets
3.3V: C27.1 C28.1 C29.2 C32.1 C33.1 C34.1 R20.2 R24.1 U7.8(V+) U8.9(VDDIO) U8.16(VBAT) U9.8(V+) U10.8(V+) Y2.1(STBY) Y2.4(VDD)
GND: C27.2 C28.2 C29.1 C30.1 C31.1 C32.2 C33.2 C34.2 R22.1 R26.1 U7.4(V-) U8.25(PAD) U9.4(V-) U10.4(V-) Y2.2(GND)
VBUS_T: R21.1
CMP_DM_1: U10.1(OUTA) ; port CMP_DM_1
CMP_DM_2: U9.1(OUTA) ; port CMP_DM_2
CMP_DM_3: U7.1(OUTA) ; port CMP_DM_3
CMP_DP_1: U10.7(OUTB) ; port CMP_DP_1
CMP_DP_2: U9.7(OUTB) ; port CMP_DP_2
CMP_DP_3: U7.7(OUTB) ; port CMP_DP_3
CMP_REF_1: R25.1 R26.2 U10.2(-INA) U10.6(-INB)
CMP_REF_2: R23.1 R25.2 U9.2(-INA) U9.6(-INB)
CMP_REF_3: R20.1 R23.2 U7.2(-INA) U7.6(-INB)
DMT: R19.1 U7.3(+INA) U9.3(+INA) U10.3(+INA)
DPT: R18.1 U7.5(+INB) U9.5(+INB) U10.5(+INB)
UCLK: U8.21(XI) Y2.3(OUT)
USBT_N: R17.2 R19.2 ; port USBT.DM
USBT_P: R18.2 U8.13(DP) ; port USBT.DP
NetC30_2: C30.2 U8.15(VDD33) U8.18(ID)
NetC31_2: C31.2 U8.23(VDD18)
NetR17_1: R17.1 U8.14(DM)
NetR21_2: R21.2 U8.17(VBUS)
NetR22_2: R22.2 U8.19(RBIAS)
NetR24_2: R24.2 U8.22(RESETB)
NetU6_8: U8.12(D7) ; port ULPI.D7
NetU6_9: U8.11(D6) ; port ULPI.D6
NetU6_10: U8.10(D5) ; port ULPI.D5
NetU6_13: U8.8(D4) ; port ULPI.D4
NetU6_15: U8.7(D3) ; port ULPI.D3
NetU6_16: U8.6(D2) ; port ULPI.D2
NetU6_17: U8.5(D1) ; port ULPI.D1
NetU6_18: U8.4(D0) ; port ULPI.D0
NetU6_19: U8.3(NXT) ; port ULPI.NXT
NetU6_20: U8.2(CLKOUT) ; port ULPI.CLKOUT
NetU6_21: U8.1(DIR) ; port ULPI.DIR
NetU6_24: U8.24(STP) ; port ULPI.STP

Not connected (* = marked no-connect by the designer): U8 20(XO)

### Notes on the sheet
- Title
- Size:
- Date:
- A4
- Number:
- Time:
- Revision:
- Sheet
- of
- File:

### Library data of the parts
C27-C29 C32-C34 = CM0464: as C6 on sheet Host; Value: 100nF; PartId: CM0464; Supplier 1: Digi-Key; Supplier Part Number 1: 490-5920-2-ND; ComponentLink1Description: Datasheet; ComponentLink1URL: http://www.murata.com/~/media/webrenewal/support/library/catalog/products/capacitor/mlcc/c02e.pdf; ComponentLink2Description: Digi-Key Listing; ComponentLink2URL: https://www.digikey.com/product-detail/en/murata-electronics-north-america/GRM155R61E104KA87D/490-5920-2-ND/3693681; TemperatureCoefficient: X5R; Voltage: 25V; Price: 0.0048; Device Package: 0402 (1005 Metric)
C30 C31 = CM0490: CAP CER 1UF 6.3V X5R 0402; Part Number: GRM155R60J105KE19D; Manufacturer: Murata; TemperatureRange: -55C ~ 85C; Tolerance: 10%; Value: 1uF; PartId: CM0490; Supplier 1: Digi-Key; Supplier Part Number 1: 490-1320-2-ND; ComponentLink1Description: Datasheet; ComponentLink1URL: http://www.murata.com/~/media/webrenewal/support/library/catalog/products/capacitor/mlcc/c02e.pdf; ComponentLink2Description: Digi-Key Listing; ComponentLink2URL: https://www.digikey.com/product-detail/en/murata-electronics-north-america/GRM155R60J105KE19D/490-1320-2-ND/587208; TemperatureCoefficient: X5R; Voltage: 6.3V; Price: 0.006; Device Package: 0402 (1005 Metric)
R17 = RC0971: RES SMD 0 OHM 5% 1/16W 0402; Part Number: RC0402JR-070RL; Manufacturer: Yageo; TemperatureRange: -55C ~ 155C; TemperatureCoefficient: 100ppm/C; PowerRating: 0.0625W, 1/16W; PartId: RC0971; Value: 0; Supplier 1: Mouser; Supplier Part Number 1: 603-RC0402JR-070RL; ComponentLink1Description: Datasheet; ComponentLink1URL: http://www.yageo.com/NewPortal/yageodocoutput?fileName=/pdf/R-Chip/PYu-RC_Group_51_RoHS_L_9.pdf; Tolerance: 5%; Price: 0.0043; Type: Thick Film; Device Package: 0402 (1005 Metric)
R18 R19 = RC1342: RES SMD 470 OHM 1% 1/16W 0402; Part Number: RC0402FR-07470RL; Manufacturer: Yageo; TemperatureRange: -55C ~ 155C; TemperatureCoefficient: 100ppm/C; PowerRating: 0.0625W, 1/16W; PartId: RC1342; Value: 470; Supplier 1: Mouser; Supplier Part Number 1: 603-RC0402FR-07470RL; ComponentLink1Description: Datasheet; ComponentLink1URL: http://www.yageo.com/NewPortal/yageodocoutput?fileName=/pdf/R-Chip/PYu-RC_Group_51_RoHS_L_9.pdf; Tolerance: 1%; Price: 0.0043; Type: Thick Film; Device Package: 0402 (1005 Metric)
R20 R24 = RC1531: as R7 on sheet Host; PartId: RC1531; Value: 10K; Supplier 1: Mouser; Supplier Part Number 1: 603-RC0402FR-0710KL; ComponentLink1Description: Datasheet; ComponentLink1URL: http://www.yageo.com/NewPortal/yageodocoutput?fileName=/pdf/R-Chip/PYu-RC_Group_51_RoHS_L_9.pdf; Tolerance: 1%; Price: 0.0043; Type: Thick Film; Device Package: 0402 (1005 Metric)
R21 = RC1570: RES SMD 20K OHM 1% 1/16W 0402; Part Number: RC0402FR-0720KL; Manufacturer: Yageo; TemperatureRange: -55C ~ 155C; TemperatureCoefficient: 100ppm/C; PowerRating: 0.0625W, 1/16W; PartId: RC1570; Value: 20K; Supplier 1: Mouser; Supplier Part Number 1: 603-RC0402FR-0720KL; ComponentLink1Description: Datasheet; ComponentLink1URL: http://www.yageo.com/NewPortal/yageodocoutput?fileName=/pdf/R-Chip/PYu-RC_Group_51_RoHS_L_9.pdf; Tolerance: 1%; Price: 0.0043; Type: Thick Film; Device Package: 0402 (1005 Metric)
R22 = RC1517: RES SMD 8.06K OHM 1% 1/16W 0402; Part Number: RC0402FR-078K06L; Manufacturer: Yageo; TemperatureRange: -55C ~ 155C; TemperatureCoefficient: 100ppm/C; PowerRating: 0.0625W, 1/16W; PartId: RC1517; Value: 8.06K; Supplier 1: Mouser; Supplier Part Number 1: 603-RC0402FR-078K06L; ComponentLink1Description: Datasheet; ComponentLink1URL: http://www.yageo.com/NewPortal/yageodocoutput?fileName=/pdf/R-Chip/PYu-RC_Group_51_RoHS_L_9.pdf; Tolerance: 1%; Price: 0.0043; Type: Thick Film; Device Package: 0402 (1005 Metric)
R23 = RC1600: RES SMD 33K OHM 1% 1/16W 0402; Part Number: RC0402FR-0733KL; Manufacturer: Yageo; TemperatureRange: -55C ~ 155C; TemperatureCoefficient: 100ppm/C; PowerRating: 0.0625W, 1/16W; PartId: RC1600; Value: 33K; Supplier 1: Mouser; Supplier Part Number 1: 603-RC0402FR-0733KL; ComponentLink1Description: Datasheet; ComponentLink1URL: http://www.yageo.com/NewPortal/yageodocoutput?fileName=/pdf/R-Chip/PYu-RC_Group_51_RoHS_L_9.pdf; Tolerance: 1%; Price: 0.0043; Type: Thick Film; Device Package: 0402 (1005 Metric)
R25 R26 = RC1484: RES SMD 4.7K OHM 1% 1/16W 0402; Part Number: RC0402FR-074K7L; Manufacturer: Yageo; TemperatureRange: -55C ~ 155C; TemperatureCoefficient: 100ppm/C; PowerRating: 0.0625W, 1/16W; PartId: RC1484; Value: 4.7K; Supplier 1: Mouser; Supplier Part Number 1: 603-RC0402FR-074K7L; ComponentLink1Description: Datasheet; ComponentLink1URL: http://www.yageo.com/NewPortal/yageodocoutput?fileName=/pdf/R-Chip/PYu-RC_Group_51_RoHS_L_9.pdf; Tolerance: 1%; Price: 0.0043; Type: Thick Film; Device Package: 0402 (1005 Metric)
U7 U9 U10 = UC0019: IC COMP PP TSSOP-8; Manufacturer: AD; PartId: UC0019; Part Number: MAX9032AUA+; Supplier 1: Digi-Key; Supplier Part Number 1: MAX9032AUA+-ND; Supplier 2: Mouser; Supplier Part Number 2: 700-MAX9032AUA; ComponentLink1Description: Datasheet; ComponentLink1URL: https://www.analog.com/media/en/technical-documentation/data-sheets/MAX9030-MAX9034.pdf; Price: 0.7; Type: Comparator; Device Package: TSSOP-8; Operating Temperature: -40C ~ 125C
U8 = IIF028: USB ULPI PHY 24QFN; Manufacturer: Microchip; PartId: IIF028; Part Number: USB3343-CP; Supplier 1: Digi-Key; Supplier Part Number 1: USB3343-CP-ND; Supplier 2: Mouser; Supplier Part Number 2: 579-USB3343-CP; ComponentLink1Description: Datasheet; ComponentLink1URL: https://ww1.microchip.com/downloads/en/DeviceDoc/USB334x-Data-Sheet-DS00002646A.pdf; Price: 1.8; Type: USB ULPI Phy; Device Package: 24-QFN (4x4); Operating Temperature: -40C ~ 85C
Y2 = OX0070: OSC XO 26MHz 3.3V 2016 SMD; Part Number: 831056245; Manufacturer: Wurth; Frequency Stability: 50ppm; Load Capacitance: 15pF; PartId: OX0070; Value: 26MHz; Supplier 1: Mouser; Supplier Part Number 1: 710-831056245; ComponentLink1Description: Datasheet; ComponentLink1URL: https://www.we-online.com/redexpert/spec/831056245?ad; Price: 0.4; Type: XO (Standard); Device Package: 4-SMD, 2016; Series: IQXO-540; Frequency: 26MHz; Supply Voltage: 3.3V

## Nets that join several sheets
3.3V: Port (C2.2 R2.2 U2.5), Host (27 pins), CPLD (23 pins), Target (15 pins)
GND: Port (21 pins), Host (25 pins), CPLD (23 pins), Target (15 pins)
VBUS_T: Port (7 pins), Target (R21.1)
CMP_DM_1: CPLD (U6.96), Target (U10.1)
CMP_DM_2: CPLD (U6.97), Target (U9.1)
CMP_DM_3: CPLD (U6.98), Target (U7.1)
CMP_DP_1: CPLD (U6.3), Target (U10.7)
CMP_DP_2: CPLD (U6.2), Target (U9.7)
CMP_DP_3: CPLD (U6.1), Target (U7.7)
CTRL_CLK: Host (U4.33), CPLD (U6.71)
CTRL_DATA: Host (U4.36), CPLD (U6.68)
FIFOADR0: Host (U4.37), CPLD (U6.67)
FIFOADR1: Host (U4.38), CPLD (U6.65)
FLAGA: Host (U4.29), CPLD (U6.78)
FLAGB: Host (U4.30), CPLD (U6.75)
FLAGC: Host (U4.31), CPLD (U6.74)
GPIO: Host (U4.40), CPLD (U6.63)
IFCLK: Host (U4.13), CPLD (U6.88)
JTAGEN: Host (U4.34), CPLD (R16.1 U6.70 U6.82)
NetU6_8: CPLD (U6.8), Target (U8.12)
NetU6_9: CPLD (U6.9), Target (U8.11)
NetU6_10: CPLD (U6.10), Target (U8.10)
NetU6_13: CPLD (U6.13), Target (U8.8)
NetU6_15: CPLD (U6.15), Target (U8.7)
NetU6_16: CPLD (U6.16), Target (U8.6)
NetU6_17: CPLD (U6.17), Target (U8.5)
NetU6_18: CPLD (U6.18), Target (U8.4)
NetU6_19: CPLD (U6.19), Target (U8.3)
NetU6_20: CPLD (U6.20), Target (U8.2)
NetU6_21: CPLD (U6.21), Target (U8.1)
NetU6_24: CPLD (U6.24), Target (U8.24)
PKTEND: Host (U4.39), CPLD (U6.64)
SLOE: Host (U4.35), CPLD (U6.69)
SLRD: Host (U4.1), CPLD (U6.48)
SLWR: Host (U4.2), CPLD (U6.49)
USBH_N: Port (U1.4), Host (U4.9)
USBH_P: Port (U1.6), Host (U4.8)
USBT_N: Port (J3.2 U3.6), Target (R17.2 R19.2)
USBT_P: Port (J3.3 U3.4), Target (R18.2 U8.13)